# Altium schematic sheet Sheet1.SchDoc
size A
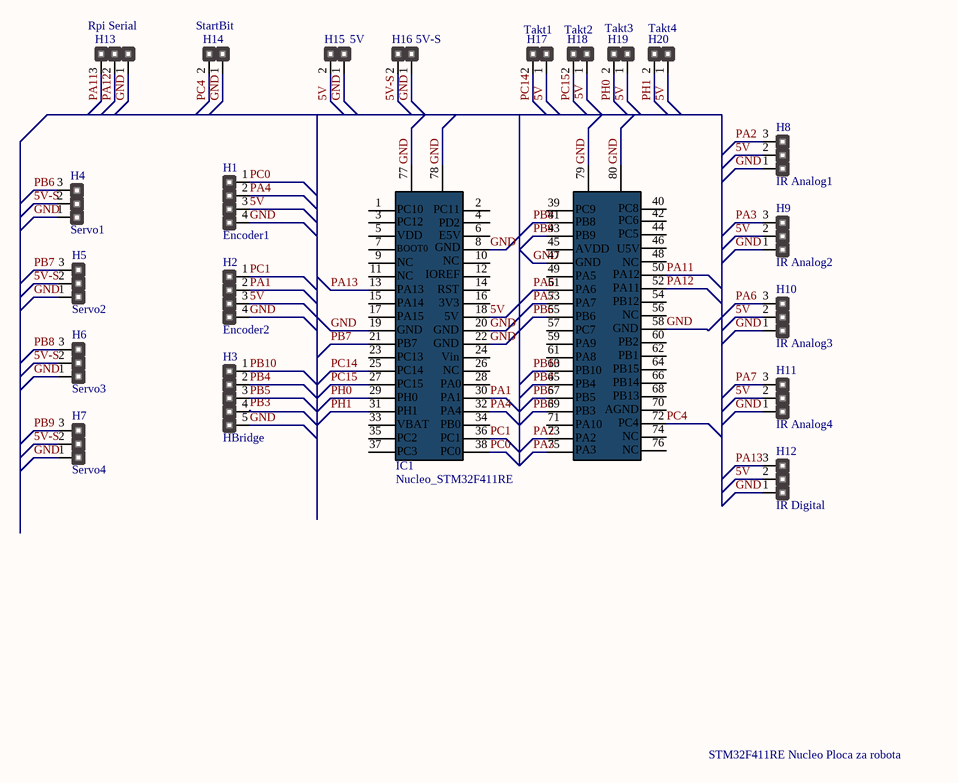
[diagram p0: Sheet1.SchDoc]

## Parts
H1  Encoder1  [Header1x4]
H2  Encoder2  [Header1x4]
H3  HBridge  [Header1x5]
H4  Servo1  [Header 1x3]
H5  Servo2  [Header 1x3]
H6  Servo3  [Header 1x3]
H7  Servo4  [Header 1x3]
H8  IR Analog1  [Header 1x3]
H9  IR Analog2  [Header 1x3]
H10  IR Analog3  [Header 1x3]
H11  IR Analog4  [Header 1x3]
H12  IR Digital  [Header 1x3]
H13  Rpi Serial  [Header 1x3]
H14  StartBit  [Header1x2]
H15  5V  [Header1x2]
H16  5V-S  [Header1x2]
H17  Takt1  [Header1x2]
H18  Takt2  [Header1x2]
H19  Takt3  [Header1x2]
H20  Takt4  [Header1x2]
IC1  Nucleo_STM32F411RE  [Nucleo411]

## Nets
5V: H1.3 H2.3 H8.2 H9.2 H10.2 H11.2 H12.2 H15.2 H17.1 H18.1 H19.1 H20.1 IC1.18
5V-S: H4.2 H5.2 H6.2 H7.2 H16.2
GND: H1.4 H2.4 H3.5 H4.1 H5.1 H6.1 H7.1 H8.1 H9.1 H10.1 H11.1 H12.1 H13.1 H14.1 H15.1 H16.1 IC1.8 IC1.19 IC1.20 IC1.22 IC1.47 IC1.58 IC1.77 IC1.78 IC1.79 IC1.80
PA1: H2.2 IC1.30
PA2: H8.3 IC1.73
PA3: H9.3 IC1.75
PA4: H1.2 IC1.32
PA6: H10.3 IC1.51
PA7: H11.3 IC1.53
PA11: H13.3 IC1.50
PA12: H13.2 IC1.52
PA13: H12.3 IC1.13
PB3: H3.4 IC1.69
PB4: H3.2 IC1.65
PB5: H3.3 IC1.67
PB6: H4.3 IC1.55
PB7: H5.3 IC1.21
PB8: H6.3 IC1.41
PB9: H7.3 IC1.43
PB10: H3.1 IC1.63
PC0: H1.1 IC1.38
PC1: H2.1 IC1.36
PC4: H14.2 IC1.72
PC14: H17.2 IC1.25
PC15: H18.2 IC1.27
PH0: H19.2 IC1.29
PH1: H20.2 IC1.31

Not connected (* = marked no-connect by the designer): IC1 1 2 3(2) 4(3) 5(3) 6(4) 7(4) 9(5) 10(6) 11(6) 12(7) 14(8) 15(8) 16(9) 17(9) 23(12) 24(13) 26(14) 28(15) 33(17) 34(18) 35(18) 37(19) 39 40 42(41) 44(42) 45(42) 46(43) 48(44) 49(44) 54(47) 56(48) 57(48) 59(49) 60(50) 61(50) 62(51) 64(52) 66(53) 68(54) 70(55) 71(55) 74(57) 76(58)

## Notes on the sheet
- STM32F411RE Nucleo Ploca za robota
- (in symbol Nucleo_STM32F411RE) PC10; PC11; PC9; PC8; PC12; PD2; PB8; PC6; VDD; E5V; PB9; PC5; BOOT0; GND; AVDD; U5V; NC; IOREF; PA5; PA12; PA13; RST; PA6; PA11; PA14; 3V3; PA7; PB12; PA15; 5V; PB6; PC7; PB7; PA9; PB2; PC13; Vin; PA8; PB1; PC14; PB10; PB15; PC15; PA0; PB4; PB14; PH0; PA1; PB5; PB13; PH1; PA4; PB3; AGND; VBAT; PB0; PA10; PC4; PC2; PC1; PA2; PC3; PC0; PA3

## Library data of the parts
H1 H2 = Header1x4
H3 = Header1x5
H4-H13 = Header 1x3
H14-H20 = Header1x2